# EAGLE schematic oeuf_sous_vide (EAGLE 6.5.0)
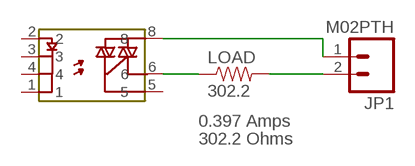
[diagram p0: schematic, sheet 1]

## Parts
JP1  M02PTH  [1X02]
LOAD  302.2  RESISTORAXIAL-0.3  [AXIAL-0.3]
U$1  PR39MF5  [PR39MF51]

## Nets
N$1: LOAD.P$1 U$1.6
N$2: JP1.2 LOAD.P$2
N$3: JP1.1 U$1.8
Unconnected: U$1.1 U$1.2 U$1.3 U$1.4 U$1.5

## Notes on the sheet
- 0.397 Amps
- 302.2 Ohms

## Library data of the parts
JP1 = SparkFun-Connectors:M02: Standard 2-pin 0.1" header. Use with - straight break away headers ( PRT-00116) - right angle break away headers (PRT-00553) - swiss pins (PRT-00743) - machine pins (PRT-00117) - female headers (PRT-00115) Molex polarized connector foot print use with: PRT-08233 with associated crimp pins and housings. 2.54_SCREWTERM for use with PRT-10571. 3.5mm Screw Terminal footprints for PRT-08084 5mm Screw Terminal footprints for use with PRT-08433
LOAD = SparkFun-Resistors:RESISTOR: Resistor Basic schematic elements and footprints for 0603, 1206, and PTH resistors.
U$1 = barbary_enterprises:PR39MF5